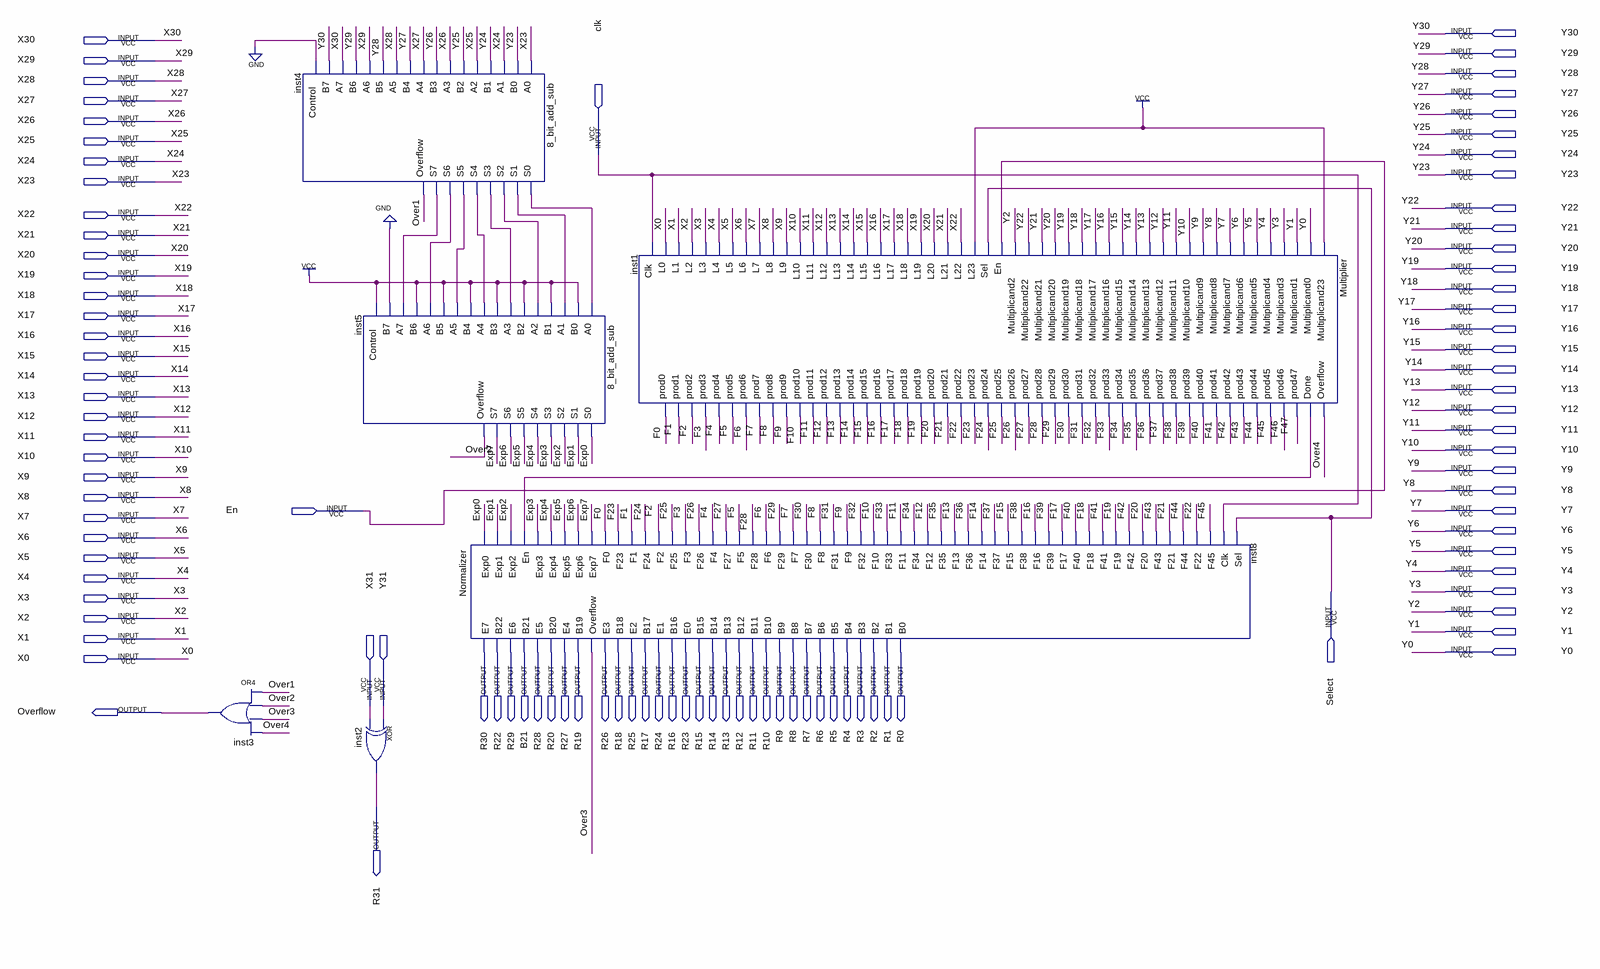
[diagram p0: schematic sheet]
// Quartus schematic Multiplication.bdf as structural Verilog: 6 symbols, 100 pins
module Multiplication (
  input  Y30,
  input  X30,
  input  Y29,
  input  X29,
  input  Y28,
  input  X28,
  input  Y27,
  input  X27,
  input  Y26,
  input  X26,
  input  Y25,
  input  X25,
  input  clk,
  input  Y24,
  input  X24,
  input  Y23,
  input  X23,
  input  Y22,
  input  X22,
  input  Y21,
  input  X21,
  input  Y20,
  input  X20,
  input  Y19,
  input  X19,
  input  Y18,
  input  X18,
  input  Y17,
  input  X17,
  input  Y16,
  input  X16,
  input  Y15,
  input  X15,
  input  Y14,
  input  X14,
  input  Y13,
  input  X13,
  input  Y12,
  input  X12,
  input  Y11,
  input  X11,
  input  Y10,
  input  X10,
  input  Y9,
  input  X9,
  input  Y8,
  input  X8,
  input  En,
  input  Y7,
  input  X7,
  input  Y6,
  input  X6,
  input  Y5,
  input  X5,
  input  Y4,
  input  X4,
  input  Select,
  input  Y3,
  input  X3,
  input  Y2,
  input  X2,
  input  Y1,
  input  X1,
  input  Y0,
  input  X0,
  input  X31,
  input  Y31,
  output R30,
  output R22,
  output R29,
  output B21,
  output R28,
  output R20,
  output R27,
  output R19,
  output R26,
  output R18,
  output R25,
  output R17,
  output R24,
  output R16,
  output R23,
  output R15,
  output R14,
  output R13,
  output R12,
  output R11,
  output R10,
  output R9,
  output R8,
  output R7,
  output R6,
  output R5,
  output R4,
  output R3,
  output R2,
  output R1,
  output R0,
  output Overflow,
  output R31
);

  wire Exp0, Exp1, Exp2, Exp3, Exp4, Exp5, Exp6, Exp7, F0, F1, F2, F3, F4, F5, F6, F7, F8, F9, F10, F11, F12,
       F13, F14, F15, F16, F17, F18, F19, F20, F21, F22, F23, F24, F25, F26, F27, F28, F29, F30, F31, F32,
       F33, F34, F35, F36, F37, F38, F39, F40, F41, F42, F43, F44, F45, F46, F47, inst1_done, inst4_s0,
       inst4_s1, inst4_s2, inst4_s3, inst4_s4, inst4_s5, inst4_s6, inst4_s7, Over1, Over2, Over3, Over4;

  or inst3 (Overflow, Over1, Over2, Over3, Over4);
  \8_bit_add_sub  inst4 (
    .A0(X23), .B0(Y23), .A1(X24), .B1(Y24), .A2(X25), .B2(Y25), .A3(X26), .B3(Y26), .A4(X27), .B4(Y27),
    .A5(X28), .B5(Y28), .A6(X29), .B6(Y29), .A7(X30), .B7(Y30), .Control(1'b0), .S0(inst4_s0), .S1(inst4_s1),
    .S2(inst4_s2), .S3(inst4_s3), .S4(inst4_s4), .S5(inst4_s5), .S6(inst4_s6), .S7(inst4_s7), .Overflow(Over1));
  \8_bit_add_sub  inst5 (
    .A0(inst4_s0), .B0(1'b1), .A1(inst4_s1), .B1(1'b1), .A2(inst4_s2), .B2(1'b1), .A3(inst4_s3), .B3(1'b1),
    .A4(inst4_s4), .B4(1'b1), .A5(inst4_s5), .B5(1'b1), .A6(inst4_s6), .B6(1'b1), .A7(inst4_s7), .B7(1'b0),
    .Control(1'b1), .S0(Exp0), .S1(Exp1), .S2(Exp2), .S3(Exp3), .S4(Exp4), .S5(Exp5), .S6(Exp6), .S7(Exp7),
    .Overflow(Over2));
  xor inst2 (R31, Y31, X31);
  Normalizer inst8 (
    .Exp0(Exp0), .Exp1(Exp1), .Exp2(Exp2), .En(inst1_done), .Exp3(Exp3), .Exp4(Exp4), .Exp5(Exp5),
    .Exp6(Exp6), .Exp7(Exp7), .F0(F0), .F23(F23), .F1(F1), .F24(F24), .F2(F2), .F25(F25), .F3(F3), .F26(F26),
    .F4(F4), .F27(F27), .F5(F5), .F28(F28), .F6(F6), .F29(F29), .F7(F7), .F30(F30), .F8(F8), .F31(F31),
    .F9(F9), .F32(F32), .F10(F10), .F33(F33), .F11(F11), .F34(F34), .F12(F12), .F35(F35), .F13(F13),
    .F36(F36), .F14(F14), .F37(F37), .F15(F15), .F38(F38), .F16(F16), .F39(F39), .F17(F17), .F40(F40),
    .F18(F18), .F41(F41), .F19(F19), .F42(F42), .F20(F20), .F43(F43), .F21(F21), .F44(F44), .F22(F22),
    .F45(F45), .Clk(clk), .Sel(Select), .E7(R30), .B22(R22), .E6(R29), .B21(B21), .E5(R28), .B20(R20),
    .E4(R27), .B19(R19), .Overflow(Over3), .E3(R26), .B18(R18), .E2(R25), .B17(R17), .E1(R24), .B16(R16),
    .E0(R23), .B15(R15), .B14(R14), .B13(R13), .B12(R12), .B11(R11), .B10(R10), .B9(R9), .B8(R8), .B7(R7),
    .B6(R6), .B5(R5), .B4(R4), .B3(R3), .B2(R2), .B1(R1), .B0(R0));
  Multiplier inst1 (
    .Multiplicand23(1'b1), .Multiplicand0(Y0), .Multiplicand1(Y1), .Multiplicand3(Y3), .Multiplicand4(Y4),
    .Multiplicand5(Y5), .Multiplicand6(Y6), .Multiplicand7(Y7), .Multiplicand8(Y8), .Multiplicand9(Y9),
    .Multiplicand10(Y10), .Multiplicand11(Y11), .Multiplicand12(Y12), .Multiplicand13(Y13),
    .Multiplicand14(Y14), .Multiplicand15(Y15), .Multiplicand16(Y16), .Multiplicand17(Y17),
    .Multiplicand18(Y18), .Multiplicand19(Y19), .Multiplicand20(Y20), .Multiplicand21(Y21),
    .Multiplicand22(Y22), .Multiplicand2(Y2), .En(En), .Sel(Select), .L23(1'b1), .L22(X22), .L21(X21),
    .L20(X20), .L19(X19), .L18(X18), .L17(X17), .L16(X16), .L15(X15), .L14(X14), .L13(X13), .L12(X12),
    .L11(X11), .L10(X10), .L9(X9), .L8(X8), .L7(X7), .L6(X6), .L5(X5), .L4(X4), .L3(X3), .L2(X2), .L1(X1),
    .L0(X0), .Clk(clk), .Overflow(Over4), .Done(inst1_done), .prod47(F47), .prod46(F46), .prod45(F45),
    .prod44(F44), .prod43(F43), .prod42(F42), .prod41(F41), .prod40(F40), .prod39(F39), .prod38(F38),
    .prod37(F37), .prod36(F36), .prod35(F35), .prod34(F34), .prod33(F33), .prod32(F32), .prod31(F31),
    .prod30(F30), .prod29(F29), .prod28(F28), .prod27(F27), .prod26(F26), .prod25(F25), .prod24(F24),
    .prod23(F23), .prod22(F22), .prod21(F21), .prod20(F20), .prod19(F19), .prod18(F18), .prod17(F17),
    .prod16(F16), .prod15(F15), .prod14(F14), .prod13(F13), .prod12(F12), .prod11(F11), .prod10(F10),
    .prod9(F9), .prod8(F8), .prod7(F7), .prod6(F6), .prod5(F5), .prod4(F4), .prod3(F3), .prod2(F2),
    .prod1(F1), .prod0(F0));
endmodule
